# Altium schematic sheet Main.SchDoc
size A3; SheetNumber: 1; SheetTotal: 1
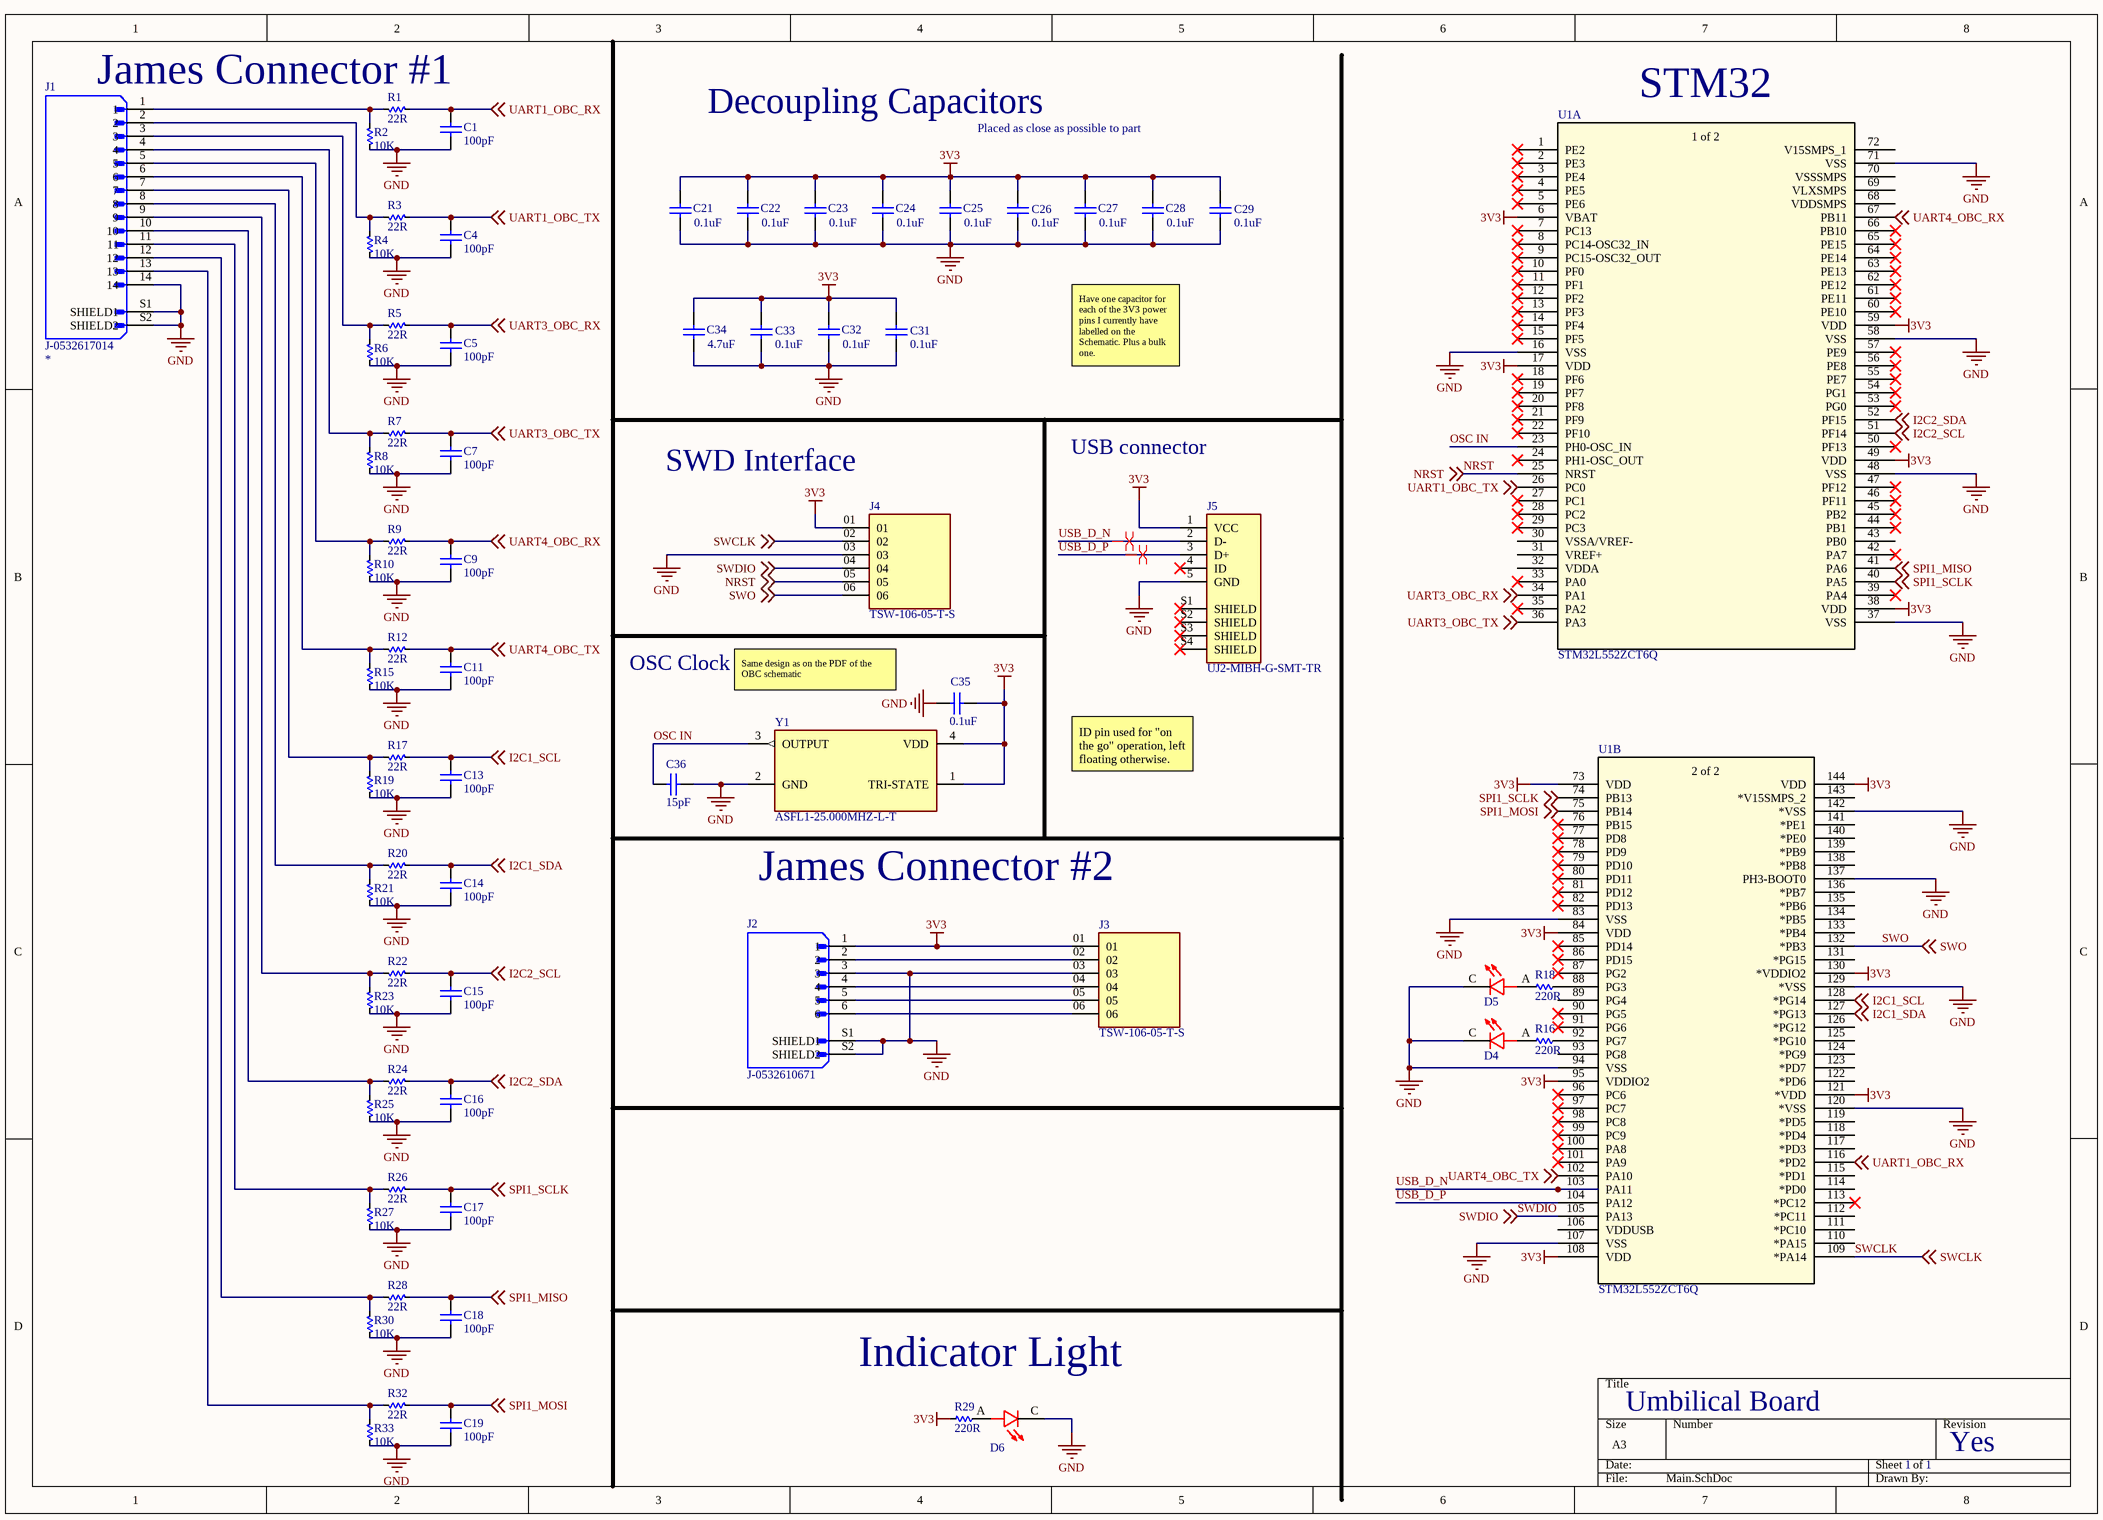
[diagram p0: Main.SchDoc]

## Parts
C1  100pF  [CAPC1608X95X40NL15T15]
C4  100pF  [CAPC1608X95X40NL15T15]
C5  100pF  [CAPC1608X95X40NL15T15]
C7  100pF  [CAPC1608X95X40NL15T15]
C9  100pF  [CAPC1608X95X40NL15T15]
C11  100pF  [CAPC1608X95X40NL15T15]
C13  100pF  [CAPC1608X95X40NL15T15]
C14  100pF  [CAPC1608X95X40NL15T15]
C15  100pF  [CAPC1608X95X40NL15T15]
C16  100pF  [CAPC1608X95X40NL15T15]
C17  100pF  [CAPC1608X95X40NL15T15]
C18  100pF  [CAPC1608X95X40NL15T15]
C19  100pF  [CAPC1608X95X40NL15T15]
C21  0.1uF  [CAPC1608X95X40NL15T15]
C22  0.1uF  [CAPC1608X95X40NL15T15]
C23  0.1uF  [CAPC1608X95X40NL15T15]
C24  0.1uF  [CAPC1608X95X40NL15T15]
C25  0.1uF  [CAPC1608X95X40NL15T15]
C26  0.1uF  [CAPC1608X95X40NL15T15]
C27  0.1uF  [CAPC1608X95X40NL15T15]
C28  0.1uF  [CAPC1608X95X40NL15T15]
C29  0.1uF  [CAPC1608X95X40NL15T15]
C31  0.1uF  [CAPC1608X95X40NL15T15]
C32  0.1uF  [CAPC1608X95X40NL15T15]
C33  0.1uF  [CAPC1608X95X40NL15T15]
C34  4.7uF  [CAPC1608X95X40NL15T15]
C35  0.1uF  [CAPC1608X95X40NL15T15]
C36  15pF  [CAPC1608X95X40NL15T15]
D4  D-SML-D12U1WT86  [D-SML-D12U1WT86]  (value not drawn)
D5  D-SML-D12U1WT86  [D-SML-D12U1WT86]  (value not drawn)
D6  D-SML-D12U1WT86  [D-SML-D12U1WT86]  (value not drawn)
J1  J-0532617014  [J-532617014]
J2  J-0532610671  [J-0532610671]
J3  TSW-106-05-T-S  [TSW-106-05-T-S]
J4  TSW-106-05-T-S  [TSW-106-05-T-S]
J5  UJ2-MIBH-G-SMT-TR  [UJ2-MIBH-G-SMT-TR]
R1  22R  [0603]
R2  10K  [0603]
R3  22R  [0603]
R4  10K  [0603]
R5  22R  [0603]
R6  10K  [0603]
R7  22R  [0603]
R8  10K  [0603]
R9  22R  [0603]
R10  10K  [0603]
R12  22R  [0603]
R15  10K  [0603]
R16  220R  [0603]
R17  22R  [0603]
R18  220R  [0603]
R19  10K  [0603]
R20  22R  [0603]
R21  10K  [0603]
R22  22R  [0603]
R23  10K  [0603]
R24  22R  [0603]
R25  10K  [0603]
R26  22R  [0603]
R27  10K  [0603]
R28  22R  [0603]
R29  220R  [0603]
R30  10K  [0603]
R32  22R  [0603]
R33  10K  [0603]
U1  STM32L552ZCT6Q  [STM32L552ZCT6Q]  (parts A,B of 2)
Y1  ASFL1-25.000MHZ-L-T  [XTAL_ASFL1-25.000MHZ-L-T]

## Nets
3V3: C21.2 C22.2 C23.2 C24.2 C25.2 C26.2 C27.2 C28.2 C29.2 C31.2 C32.2 C33.2 C34.2 C35.1 J2.1 J3.01 J4.01 J5.1(VCC) R29.2 U1.6(VBAT) U1.17(VDD) U1.38(VDD) U1.49(VDD) U1.59(VDD) U1.73(VDD) U1.84(VDD) U1.95(VDDIO2) U1.108(VDD) U1.121(*VDD) U1.130(*VDDIO2) U1.144(VDD) Y1.1(TRI-STATE) Y1.4(VDD)
GND: C1.1 C4.1 C5.1 C7.1 C9.1 C11.1 C13.1 C14.1 C15.1 C16.1 C17.1 C18.1 C19.1 C21.1 C22.1 C23.1 C24.1 C25.1 C26.1 C27.1 C28.1 C29.1 C31.1 C32.1 C33.1 C34.1 C35.2 C36.1 D4.C D5.C D6.C J1.14 J1.S1(SHIELD1) J1.S2(SHIELD2) J2.3 J2.S1(SHIELD1) J2.S2(SHIELD2) J3.03 J4.03 J5.5(GND) R2.1 R4.1 R6.1 R8.1 R10.1 R15.1 R19.1 R21.1 R23.1 R25.1 R27.1 R30.1 R33.1 U1.16(VSS) U1.37(VSS) U1.48(VSS) U1.58(VSS) U1.71(VSS) U1.83(VSS) U1.94(VSS) U1.107(VSS) U1.120(*VSS) U1.129(*VSS) U1.137(PH3-BOOT0) U1.142(*VSS) Y1.2(GND)
I2C1_SCL: C13.2 R17.2 U1.128(*PG14) ; off-sheet I2C1_SCL
I2C1_SDA: C14.2 R20.2 U1.127(*PG13) ; off-sheet I2C1_SDA
I2C2_SCL: C15.2 R22.2 U1.51(PF14) ; off-sheet I2C2_SCL
I2C2_SDA: C16.2 R24.2 U1.52(PF15) ; off-sheet I2C2_SDA
NRST: J4.05 U1.25(NRST) ; off-sheet NRST
OSC IN: C36.2 U1.23(PH0-OSC_IN) Y1.3(OUTPUT)
SPI1_MISO: C18.2 R28.2 U1.41(PA6) ; off-sheet SPI1_MISO
SPI1_MOSI: C19.2 R32.2 U1.75(PB14) ; off-sheet SPI1_MOSI
SPI1_SCLK: C17.2 R26.2 U1.40(PA5) U1.74(PB13) ; off-sheet SPI1_SCLK
SWCLK: J4.02 U1.109(*PA14) ; off-sheet SWCLK
SWDIO: J4.04 U1.105(PA13) ; off-sheet SWDIO
SWO: J4.06 U1.132(*PB3) ; off-sheet SWO
UART1_OBC_RX: C1.2 R1.2 U1.116(*PD2) ; off-sheet UART1_OBC_RX
UART1_OBC_TX: C4.2 R3.2 U1.26(PC0) ; off-sheet UART1_OBC_TX
UART3_OBC_RX: C5.2 R5.2 U1.34(PA1) ; off-sheet UART3_OBC_RX
UART3_OBC_TX: C7.2 R7.2 U1.36(PA3) ; off-sheet UART3_OBC_TX
UART4_OBC_RX: C9.2 R9.2 U1.67(PB11) ; off-sheet UART4_OBC_RX
UART4_OBC_TX: C11.2 R12.2 U1.102(PA10) ; off-sheet UART4_OBC_TX
USB_D_N: J5.2(D-) U1.103(PA11)
USB_D_P: J5.3(D+) U1.104(PA12)
NetD4_A: D4.A R16.1
NetD5_A: D5.A R18.1
NetD6_A: D6.A R29.1
NetJ1_1: J1.1 R1.1 R2.2
NetJ1_2: J1.2 R3.1 R4.2
NetJ1_3: J1.3 R5.1 R6.2
NetJ1_4: J1.4 R7.1 R8.2
NetJ1_5: J1.5 R9.1 R10.2
NetJ1_6: J1.6 R12.1 R15.2
NetJ1_7: J1.7 R17.1 R19.2
NetJ1_8: J1.8 R20.1 R21.2
NetJ1_9: J1.9 R22.1 R23.2
NetJ1_10: J1.10 R24.1 R25.2
NetJ1_11: J1.11 R26.1 R27.2
NetJ1_12: J1.12 R28.1 R30.2
NetJ1_13: J1.13 R32.1 R33.2
NetJ2_2: J2.2 J3.02
NetJ2_4: J2.4 J3.04
NetJ2_5: J2.5 J3.05
NetJ2_6: J2.6 J3.06
NetR16_2: R16.2 U1.92(PG7)
NetR18_2: R18.2 U1.88(PG3)

Not connected (* = marked no-connect by the designer): J5 4(ID)* S1(SHIELD)* S2(SHIELD)* S3(SHIELD)* S4(SHIELD)*; U1 1(PE2)* 2(PE3)* 3(PE4)* 4(PE5)* 5(PE6)* 7(PC13)* 8(PC14-OSC32_IN)* 9(PC15-OSC32_OUT)* 10(PF0)* 11(PF1)* 12(PF2)* 13(PF3)* 14(PF4)* 15(PF5)* 18(PF6)* 19(PF7)* 20(PF8)* 21(PF9)* 22(PF10)* 24(PH1-OSC_OUT)* 27(PC1)* 28(PC2)* 29(PC3)* 30(VSSA/VREF-) 31(VREF+) 32(VDDA) 33(PA0)* 35(PA2)* 39(PA4)* 42(PA7)* 43(PB0) 44(PB1)* 45(PB2)* 46(PF11)* 47(PF12)* 50(PF13)* 53(PG0)* 54(PG1)* 55(PE7)* 56(PE8)* 57(PE9)* 60(PE10)* 61(PE11)* 62(PE12)* 63(PE13)* 64(PE14)* 65(PE15)* 66(PB10)* 68(VDDSMPS) 69(VLXSMPS) 70(VSSSMPS) 72(V15SMPS_1) 76(PB15)* 77(PD8)* 78(PD9)* 79(PD10)* 80(PD11)* 81(PD12)* 82(PD13)* 85(PD14)* 86(PD15)* 87(PG2)* 89(PG4) 90(PG5)* 91(PG6)* 93(PG8) 96(PC6)* 97(PC7)* 98(PC8)* 99(PC9)* 100(PA8)* 101(PA9)* 106(VDDUSB) 110(*PA15) 111(*PC10) 112(*PC11) 113(*PC12)* 114(*PD0) 115(*PD1) 117(*PD3) 118(*PD4) 119(*PD5) 122(*PD6) 123(*PD7) 124(*PG9) 125(*PG10) 126(*PG12) 131(*PG15) 133(*PB4) 134(*PB5) 135(*PB6) 136(*PB7) 138(*PB8) 139(*PB9) 140(*PE0) 141(*PE1) 143(*V15SMPS_2)

## Layout directives
differential pair: USB_D_N, USB_D_P

## Notes on the sheet
- James Connector #1
- Decoupling Capacitors
- (near U1) STM32
- Placed as close as possible to part
- Have one capacitor for each of the 3V3 power pins I currently have labelled on the Schematic. Plus a bulk one.
- (near J4) SWD Interface
- USB connector
- OSC Clock
- Same design as on the PDF of the OBC schematic
- ID pin used for "on the go" operation, left floating otherwise.
- James Connector #2
- Indicator Light
- Umbilical Board
- 1
- Yes
- (in symbol STM32L552ZCT6Q, part A) 1 of 2
- (in symbol STM32L552ZCT6Q, part B) 2 of 2

## Library data of the parts
C1 C4 C5 C7 C9 C11 C13-C19 C21-C29 C31-C36 = CMP-1035-01267-2: Part Number: VJ0603A101FXACW1BC; Manufacturer: Vitramon
D4-D6 = D-SML-D12U1WT86: Red 620nm LED Indication - Discrete 2.2V 0603 _1608 Metric; Manufacturer: Rohm Semiconductor; Manufacturer Part #: SML-D12U1WT86; Distributor: Digikey; Distributor Part #: SML-D12U1WT86CT-ND
J1 = J-0532617014: Connector Header Surface Mount, Right Angle 14 position 0.049 (1.25mm); Manufacturer: Molex; Manufacturer Part #: 0532617014; Distributor: Digikey; Distributor Part #: 900-0532617014CT-ND; SnapEDA_Link: https://www.snapeda.com/parts/532617014/Molex/view-part/5064407/?ref=snap; 2: *
J2 = J-0532610671: CONN HEADER SMD R/A 6POS 1.25MM; Manfacturer: Molex; Distributor: Digi-Key; Manfacturer Part #: 0532610671; Distributor Part #: WM7624CT-ND
J3 J4 = TSW-106-05-T-S: CONN HEADER VERT 6POS 2.54MM; MF: Samtec; Availability: Unavailable; Package: None; MP: TSW-106-05-T-S; Value: *; Price: None
J5 = UJ2-MIBH-G-SMT-TR: USB JACK, 2.0, MICRO B TYPE, 5 P; MF: CUI Devices; Value: *; SnapEDA_Link: https://www.snapeda.com/parts/UJ2-MIBH-G-SMT-TR/CUI+Devices/view-part/?ref=snap; Purchase-URL: https://pricing.snapeda.com/search/part/UJ2-MIBH-G-SMT-TR/?ref=eda; Availability: In Stock; Price: None; Package: None; Check_prices: https://www.snapeda.com/parts/UJ2-MIBH-G-SMT-TR/CUI+Devices/view-part/?ref=eda; MP: UJ2-MIBH-G-SMT-TR; CUI_purchase_URL: https://www.cuidevices.com/product/interconnect/connectors/usb-connectors/uj2-mibh-g-smt-tr?utm_source=snapeda.com&utm_medium=referral&utm_campaign=snapedaBOM
R1 R3 R5 R7 R9 R12 R17 R20 R22 R24 R26 R28 R32 = RT-22R0-F-1/16W-0603: 22 Ohms ±0.5% 0.063W, 1/16W Chip Resistor 0603 (1608 Metric) - Thin Film; Manufacturer: Susumu; Manufacturer Part #: RR0816Q-220-D; ComponentLink1description: Datasheet; ComponentLink1URL: https://www.vishay.com/docs/20035/dcrcwe3.pdf; ComponentLink2description: Manufacturer Website; Distributor: Digikey; Distributor Part #: RR08Q22DCT-ND; Part Description: 22 Ohms ±0.5% 0.063W, 1/16W Chip Resistor 0603 (1608 Metric) - Thin Film; ComponentLink2URL: https://www.vishay.com/; Value: 22R
R2 R4 R6 R8 R10 R15 R19 R21 R23 R25 R27 R30 R33 = RT-10K0-F-1/16W-0603: 10 kOhms ±0.1% 0.063W, 1/16W Chip Resistor 0603 (1608 Metric) - Thin Film; Manufacturer: TE Connectivity Passive Product; Manufacturer Part #: CPF0603B10KE; ComponentLink1description: Datasheet; ComponentLink1URL: https://www.vishay.com/docs/20035/dcrcwe3.pdf; ComponentLink2description: Manufacturer Website; Distributor: Digikey; Distributor Part #: A119886CT-ND; Part Description: 10 kOhms ±0.1% 0.063W, 1/16W Chip Resistor 0603 (1608 Metric) - Thin Film; ComponentLink2URL: https://www.vishay.com/; Value: 10K
R16 R18 R29 = RT-220R-F-1/16W-0603: 220 Ohms ±0.5% 0.063W, 1/16W Chip Resistor 0603 (1608 Metric) - Thin Film; Manufacturer: Susumu; Manufacturer Part #: RR0816P-221-D; Distributor: Digikey; Distributor Part #: RR08P220DCT-ND; Part Description: 220 Ohms ±0.5% 0.063W, 1/16W Chip Resistor 0603 (1608 Metric) - Thin Film; Value: 220R
U1 = STM32L552ZCT6Q: IC MCU 32BIT 256KB FLASH 144LQFP; Mfr_Name: STMicroelectronics; Copyright: Copyright (C) 2023 Ultra Librarian. All rights reserved.; Manufacturer_Part_Number: STM32L552ZCT6Q; Digi-Key_Part_Number_1: 497-STM32L552ZCT6Q-ND; RefDes: RefDes; Type: DEV
Y1 = ASFL1-25.000MHZ-L-T: XTAL OSC XO 25.0000MHZ HCMOS TTL; Value: *; Price: None; Package: None; MP: ASFL1-25.000MHZ-L-T; Availability: Unavailable